# Altium project Opioid - rev.A0.PrjPCB
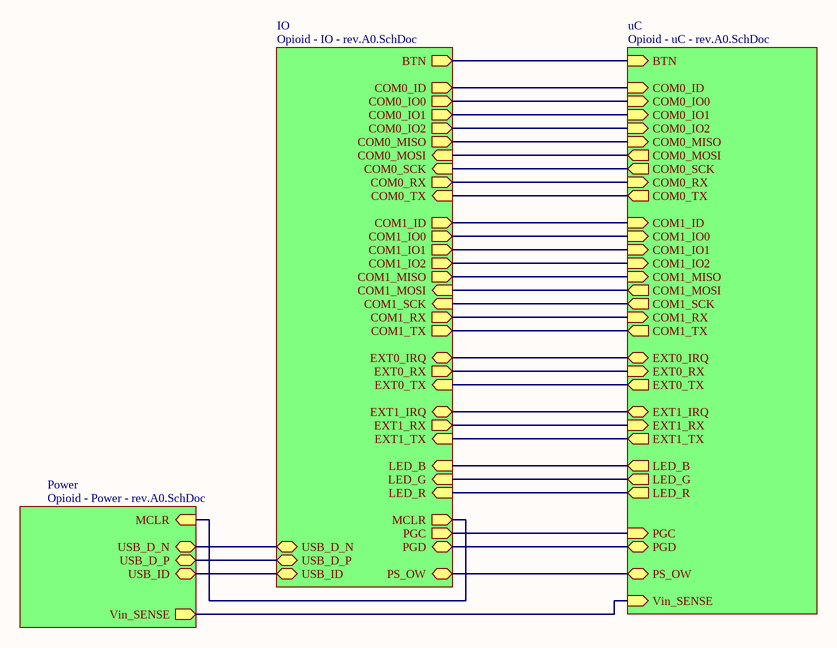
[diagram p0: Opioid - rev.A0.SchDoc]
4 sheets, 55 parts. Net scope: hierarchical (ports join the sheet entries above them; power ports are global).
Board file: Opioid - rev.A0.PcbDoc
Sheets:
  Opioid - rev.A0.SchDoc
    IO = Opioid - IO - rev.A0.SchDoc
    uC = Opioid - uC - rev.A0.SchDoc
    Power = Opioid - Power - rev.A0.SchDoc

## Sheet Opioid - rev.A0.SchDoc
size A4

### Sub-sheets
IO = Opioid - IO - rev.A0.SchDoc: BTN (out), COM0_ID (out), COM0_IO0 (out), COM0_IO1 (out), COM0_IO2 (out), COM0_MISO (out), COM0_MOSI (in), COM0_RX (out), COM0_TX (in), COM0_SCK (in), COM1_ID (out), COM1_IO0 (out), COM1_IO1 (out), COM1_IO2 (out), COM1_MISO (out), COM1_MOSI (in), COM1_SCK (in), COM1_RX (out), COM1_TX (out), EXT0_IRQ (bidir), EXT0_RX (out), EXT0_TX (in), EXT1_IRQ (bidir), EXT1_RX (out), EXT1_TX (in), LED_B (in), LED_G (in), LED_R (in), MCLR (out), PGC (out), PGD (bidir), PS_OW (bidir), USB_D_N (bidir), USB_D_P (bidir), USB_ID (bidir)
Power = Opioid - Power - rev.A0.SchDoc: MCLR (in), USB_D_N (bidir), USB_D_P (bidir), USB_ID (bidir), Vin_SENSE (out)
uC = Opioid - uC - rev.A0.SchDoc: BTN (in), COM0_ID (in), COM0_IO0 (in), COM0_IO1 (in), COM0_IO2 (in), COM0_MISO (in), COM0_MOSI (out), COM0_SCK (out), COM0_RX (in), COM0_TX (out), COM1_ID (in), COM1_IO0 (in), COM1_IO1 (in), COM1_IO2 (in), COM1_MISO (in), COM1_MOSI (out), COM1_SCK (out), COM1_TX (out), COM1_RX (in), EXT0_RX (in), EXT0_IRQ (bidir), EXT0_TX (out), EXT1_IRQ (bidir), EXT1_RX (in), EXT1_TX (out), LED_B (out), LED_G (out), LED_R (out), PS_OW (bidir), Vin_SENSE (in), PGC (in), PGD (bidir)

### Nets
USB_D_N: sheet IO/USB_D_N, sheet Power/USB_D_N
USB_D_P: sheet IO/USB_D_P, sheet Power/USB_D_P
NetB1_2: sheet IO/BTN, sheet uC/BTN
NetCOM0_1: sheet IO/COM0_ID, sheet uC/COM0_ID
NetCOM0_2: sheet IO/COM0_IO0, sheet uC/COM0_IO0
NetCOM0_3: sheet IO/COM0_IO1, sheet uC/COM0_IO1
NetCOM0_4: sheet IO/COM0_IO2, sheet uC/COM0_IO2
NetCOM0_5: sheet IO/COM0_MISO, sheet uC/COM0_MISO
NetCOM0_6: sheet IO/COM0_MOSI, sheet uC/COM0_MOSI
NetCOM0_7: sheet IO/COM0_SCK, sheet uC/COM0_SCK
NetCOM0_8: sheet IO/COM0_RX, sheet uC/COM0_RX
NetCOM0_9: sheet IO/COM0_TX, sheet uC/COM0_TX
NetCOM1_1: sheet IO/COM1_ID, sheet uC/COM1_ID
NetCOM1_2: sheet IO/COM1_IO0, sheet uC/COM1_IO0
NetCOM1_3: sheet IO/COM1_IO1, sheet uC/COM1_IO1
NetCOM1_4: sheet IO/COM1_IO2, sheet uC/COM1_IO2
NetCOM1_5: sheet IO/COM1_MISO, sheet uC/COM1_MISO
NetCOM1_6: sheet IO/COM1_MOSI, sheet uC/COM1_MOSI
NetCOM1_7: sheet IO/COM1_SCK, sheet uC/COM1_SCK
NetCOM1_8: sheet IO/COM1_RX, sheet uC/COM1_RX
NetCOM1_9: sheet IO/COM1_TX, sheet uC/COM1_TX
NetCONN1_4: sheet IO/USB_ID, sheet Power/USB_ID
NetEXT0_DATA_1: sheet IO/EXT0_IRQ, sheet uC/EXT0_IRQ
NetEXT0_DATA_2: sheet IO/EXT0_TX, sheet uC/EXT0_TX
NetEXT0_DATA_3: sheet IO/EXT0_RX, sheet uC/EXT0_RX
NetEXT1_DATA_1: sheet IO/EXT1_IRQ, sheet uC/EXT1_IRQ
NetEXT1_DATA_2: sheet IO/EXT1_TX, sheet uC/EXT1_TX
NetEXT1_DATA_3: sheet IO/EXT1_RX, sheet uC/EXT1_RX
NetICSP_1: sheet IO/MCLR, sheet Power/MCLR
NetICSP_4: sheet IO/PGD, sheet uC/PGD
NetICSP_5: sheet IO/PGC, sheet uC/PGC
NetPS_1: sheet IO/PS_OW, sheet uC/PS_OW
NetR2_2: sheet IO/LED_R, sheet uC/LED_R
NetR4_2: sheet IO/LED_G, sheet uC/LED_G
NetR5_2: sheet IO/LED_B, sheet uC/LED_B
NetR6_1: sheet uC/Vin_SENSE, sheet Power/Vin_SENSE

## Sheet Opioid - IO - rev.A0.SchDoc
size A4
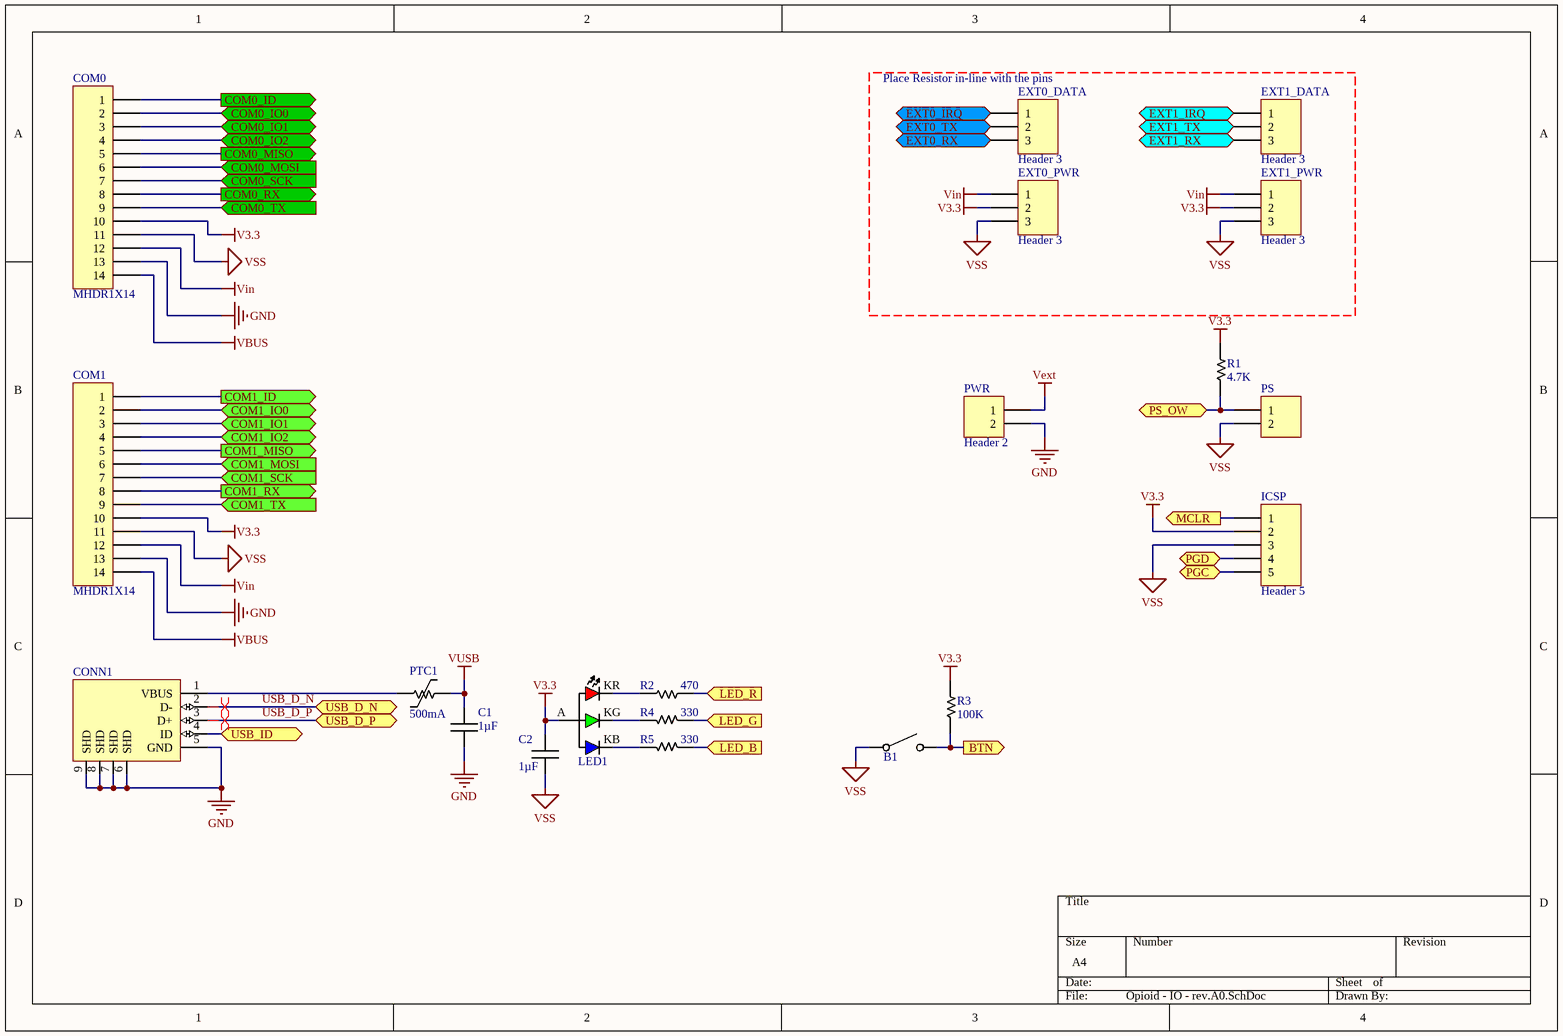
[diagram p1: Opioid - IO - rev.A0.SchDoc]

### Parts
B1  Tact Button NO  [Tact TH 4pin 6×6mm]  (value not drawn)
C1  1µF  [CAPC1608N]
C2  1µF  [CAPC1608N]
COM0  MHDR1X14  [MHDR1X14]
COM1  MHDR1X14  [MHDR1X14]
CONN1  USB-Conn Mini-B SMD  [440478]  (value not drawn)
EXT0_DATA  Header 3  [HDR1X3]
EXT0_PWR  Header 3  [HDR1X3]
EXT1_DATA  Header 3  [HDR1X3]
EXT1_PWR  Header 3  [HDR1X3]
ICSP  Header 5  [HDR1X5]
LED1  LED RGB common A  [LED 3528m]  (value not drawn)
PS  MHDR1X2  [MHDR1X2]  (value not drawn)
PTC1  500mA  [RESC3225N]
PWR  Header 2  [HDR1X2]
R1  4.7K  [RESC1608N]
R2  470  [RESC1608N]
R3  100K  [RESC1608N]
R4  330  [RESC1608N]
R5  330  [RESC1608N]

### Ports
BTN (out), COM0_ID (out), COM0_IO0 (bidir), COM0_IO1 (bidir), COM0_IO2 (bidir), COM0_MISO (out), COM0_MOSI (in), COM0_RX (out), COM0_SCK (in), COM0_TX (in), COM1_ID (out), COM1_IO0 (bidir), COM1_IO1 (bidir), COM1_IO2 (bidir), COM1_MISO (out), COM1_MOSI (in), COM1_RX (out), COM1_SCK (in), COM1_TX (in), EXT0_IRQ (bidir), EXT0_RX (out), EXT0_TX (in), EXT1_IRQ (bidir), EXT1_RX (out), EXT1_TX (in), LED_B (in), LED_G (in), LED_R (in), MCLR (out), PGC (bidir), PGD (bidir), PS_OW (bidir), USB_D_N (bidir), USB_D_P (bidir), USB_ID (bidir)

### Nets
GND: C1.1 COM0.13 COM1.13 CONN1.5(GND) CONN1.6(SHD) CONN1.7(SHD) CONN1.8(SHD) CONN1.9(SHD) PWR.2
V3.3: C2.2 COM0.10 COM1.10 EXT0_PWR.2 EXT1_PWR.2 ICSP.2 LED1.A R1.2 R3.2
VBUS: COM0.14 COM1.14
Vext: PWR.1
Vin: COM0.12 COM1.12 EXT0_PWR.1 EXT1_PWR.1
VSS: B1.1 C2.1 COM0.11 COM1.11 EXT0_PWR.3 EXT1_PWR.3 ICSP.3 PS.2
VUSB: C1.2 PTC1.2
USB_D_N: CONN1.2(D-) ; port USB_D_N
USB_D_P: CONN1.3(D+) ; port USB_D_P
NetB1_2: B1.2 R3.1 ; port BTN
NetCOM0_1: COM0.1 ; port COM0_ID
NetCOM0_2: COM0.2 ; port COM0_IO0
NetCOM0_3: COM0.3 ; port COM0_IO1
NetCOM0_4: COM0.4 ; port COM0_IO2
NetCOM0_5: COM0.5 ; port COM0_MISO
NetCOM0_6: COM0.6 ; port COM0_MOSI
NetCOM0_7: COM0.7 ; port COM0_SCK
NetCOM0_8: COM0.8 ; port COM0_RX
NetCOM0_9: COM0.9 ; port COM0_TX
NetCOM1_1: COM1.1 ; port COM1_ID
NetCOM1_2: COM1.2 ; port COM1_IO0
NetCOM1_3: COM1.3 ; port COM1_IO1
NetCOM1_4: COM1.4 ; port COM1_IO2
NetCOM1_5: COM1.5 ; port COM1_MISO
NetCOM1_6: COM1.6 ; port COM1_MOSI
NetCOM1_7: COM1.7 ; port COM1_SCK
NetCOM1_8: COM1.8 ; port COM1_RX
NetCOM1_9: COM1.9 ; port COM1_TX
NetCONN1_1: CONN1.1(VBUS) PTC1.1
NetCONN1_4: CONN1.4(ID) ; port USB_ID
NetEXT0_DATA_1: EXT0_DATA.1 ; port EXT0_IRQ
NetEXT0_DATA_2: EXT0_DATA.2 ; port EXT0_TX
NetEXT0_DATA_3: EXT0_DATA.3 ; port EXT0_RX
NetEXT1_DATA_1: EXT1_DATA.1 ; port EXT1_IRQ
NetEXT1_DATA_2: EXT1_DATA.2 ; port EXT1_TX
NetEXT1_DATA_3: EXT1_DATA.3 ; port EXT1_RX
NetICSP_1: ICSP.1 ; port MCLR
NetICSP_4: ICSP.4 ; port PGD
NetICSP_5: ICSP.5 ; port PGC
NetLED1_KB: LED1.KB R5.1
NetLED1_KG: LED1.KG R4.1
NetLED1_KR: LED1.KR R2.1
NetPS_1: PS.1 R1.1 ; port PS_OW
NetR2_2: R2.2 ; port LED_R
NetR4_2: R4.2 ; port LED_G
NetR5_2: R5.2 ; port LED_B

### Layout directives
differential pair: USB_D_N, USB_D_P

### Notes on the sheet
- (near EXT0_DATA) Place Resistor in-line with the pins

### Library data of the parts
B1 = Tact Button NO: pin to pad: 1>1+2 2>3+4
C1 C2 = Capacitor: Value: 1µF
COM0 COM1 = MHDR1X14: Header, 14-Pin; LatestRevisionDate: 17-Jul-2002; LatestRevisionNote: Re-released for DXP Platform.; Publisher: Altium Limited
EXT0_DATA EXT0_PWR EXT1_DATA EXT1_PWR = Header 3: Header, 3-Pin; LatestRevisionDate: 17-Jul-2002; LatestRevisionNote: Re-released for DXP Platform.; Publisher: Altium Limited
ICSP = Header 5: Header, 5-Pin; LatestRevisionDate: 17-Jul-2002; LatestRevisionNote: Re-released for DXP Platform.; Publisher: Altium Limited
LED1 = LED RGB common A: pin to pad: A>2 KB>3 KG>4 KR>1
PS = MHDR1X2: Header, 2-Pin; LatestRevisionDate: 17-Jul-2002; LatestRevisionNote: Re-released for DXP Platform.; Publisher: Altium Limited
PTC1 = PTC: Trip_Current: 500mA
PWR = Header 2: Header, 2-Pin; LatestRevisionDate: 17-Jul-2002; LatestRevisionNote: Re-released for DXP Platform.; Publisher: Altium Limited
R1-R5 = Resistor
  R1: Value: 4.7K
  R2: Value: 470
  R3: Value: 100K
  R4 R5: Value: 330

## Sheet Opioid - uC - rev.A0.SchDoc
size A4
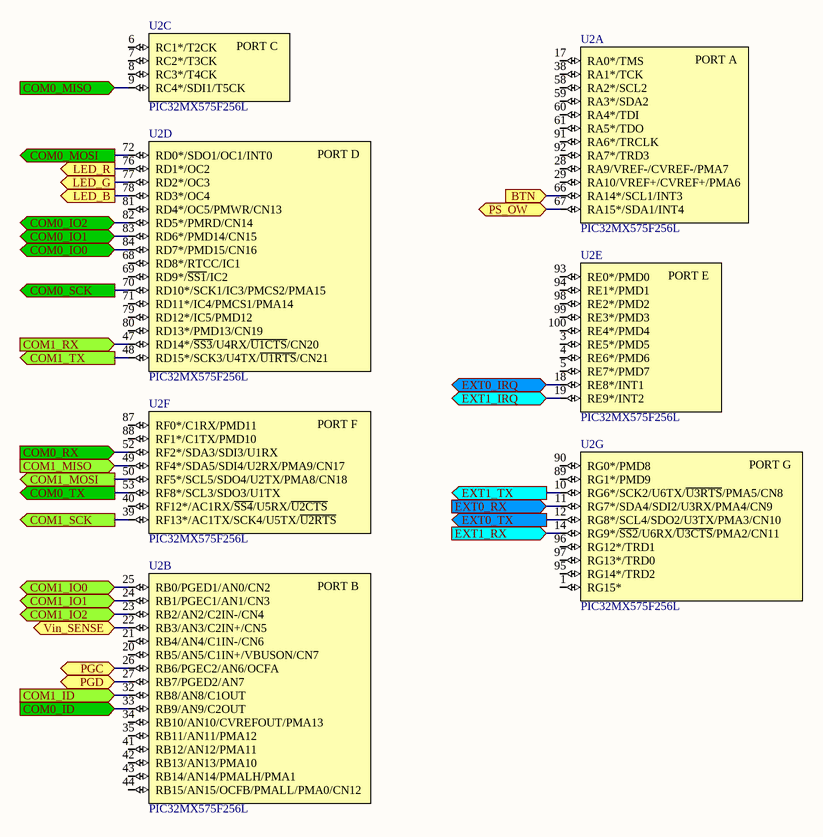
[diagram p2: Opioid - uC - rev.A0.SchDoc]

### Parts
U2  PIC32MX575F256L  [TQFP-PT100_N]  (parts A,B,C,D,E,F,G of 9)

### Ports
BTN (in), COM0_ID (in), COM0_IO0 (bidir), COM0_IO1 (bidir), COM0_IO2 (bidir), COM0_MISO (in), COM0_MOSI (out), COM0_RX (in), COM0_SCK (out), COM0_TX (out), COM1_ID (in), COM1_IO0 (bidir), COM1_IO1 (bidir), COM1_IO2 (bidir), COM1_MISO (in), COM1_MOSI (out), COM1_RX (in), COM1_SCK (out), COM1_TX (out), EXT0_IRQ (bidir), EXT0_RX (in), EXT0_TX (out), EXT1_IRQ (bidir), EXT1_RX (in), EXT1_TX (out), LED_B (out), LED_G (out), LED_R (out), PGC (bidir), PGD (bidir), PS_OW (bidir), Vin_SENSE (bidir)

### Nets
NetB1_2: U2.66(RA14*/SCL1/INT3) ; port BTN
NetCOM0_1: U2.33(RB9/AN9/C2OUT) ; port COM0_ID
NetCOM0_2: U2.84(RD7*/PMD15/CN16) ; port COM0_IO0
NetCOM0_3: U2.83(RD6*/PMD14/CN15) ; port COM0_IO1
NetCOM0_4: U2.82(RD5*/PMRD/CN14) ; port COM0_IO2
NetCOM0_5: U2.9(RC4*/SDI1/T5CK) ; port COM0_MISO
NetCOM0_6: U2.72(RD0*/SDO1/OC1/INT0) ; port COM0_MOSI
NetCOM0_7: U2.70(RD10*/SCK1/IC3/PMCS2/PMA15) ; port COM0_SCK
NetCOM0_8: U2.52(RF2*/SDA3/SDI3/U1RX) ; port COM0_RX
NetCOM0_9: U2.53(RF8*/SCL3/SDO3/U1TX) ; port COM0_TX
NetCOM1_1: U2.32(RB8/AN8/C1OUT) ; port COM1_ID
NetCOM1_2: U2.25(RB0/PGED1/AN0/CN2) ; port COM1_IO0
NetCOM1_3: U2.24(RB1/PGEC1/AN1/CN3) ; port COM1_IO1
NetCOM1_4: U2.23(RB2/AN2/C2IN-/CN4) ; port COM1_IO2
NetCOM1_5: U2.49(RF4*/SDA5/SDI4/U2RX/PMA9/CN17) ; port COM1_MISO
NetCOM1_6: U2.50(RF5*/SCL5/SDO4/U2TX/PMA8/CN18) ; port COM1_MOSI
NetCOM1_7: U2.39(RF13*/AC1TX/SCK4/U5TX/~{U2RTS}) ; port COM1_SCK
NetCOM1_8: U2.47(RD14*/~{SS3}/U4RX/~{U1CTS}/CN20) ; port COM1_RX
NetCOM1_9: U2.48(RD15*/SCK3/U4TX/~{U1RTS}/CN21) ; port COM1_TX
NetEXT0_DATA_1: U2.18(RE8*/INT1) ; port EXT0_IRQ
NetEXT0_DATA_2: U2.12(RG8*/SCL4/SDO2/U3TX/PMA3/CN10) ; port EXT0_TX
NetEXT0_DATA_3: U2.11(RG7*/SDA4/SDI2/U3RX/PMA4/CN9) ; port EXT0_RX
NetEXT1_DATA_1: U2.19(RE9*/INT2) ; port EXT1_IRQ
NetEXT1_DATA_2: U2.10(RG6*/SCK2/U6TX/~{U3RTS}/PMA5/CN8) ; port EXT1_TX
NetEXT1_DATA_3: U2.14(RG9*/~{SS2}/U6RX/~{U3CTS}/PMA2/CN11) ; port EXT1_RX
NetICSP_4: U2.27(RB7/PGED2/AN7) ; port PGD
NetICSP_5: U2.26(RB6/PGEC2/AN6/OCFA) ; port PGC
NetPS_1: U2.67(RA15*/SDA1/INT4) ; port PS_OW
NetR2_2: U2.76(RD1*/OC2) ; port LED_R
NetR4_2: U2.77(RD2*/OC3) ; port LED_G
NetR5_2: U2.78(RD3*/OC4) ; port LED_B
NetR6_1: U2.22(RB3/AN3/C2IN+/CN5) ; port Vin_SENSE

Not connected (* = marked no-connect by the designer): U2 1(RG15*) 3(RE5*/PMD5) 4(RE6*/PMD6) 5(RE7*/PMD7) 6(RC1*/T2CK) 7(RC2*/T3CK) 8(RC3*/T4CK) 17(RA0*/TMS) 20(RB5/AN5/C1IN+/VBUSON/CN7) 21(RB4/AN4/C1IN-/CN6) 28(RA9/VREF-/CVREF-/PMA7) 29(RA10/VREF+/CVREF+/PMA6) 34(RB10/AN10/CVREFOUT/PMA13) 35(RB11/AN11/PMA12) 38(RA1*/TCK) 40(RF12*/AC1RX/~{SS4}/U5RX/~{U2CTS}) 41(RB12/AN12/PMA11) 42(RB13/AN13/PMA10) 43(RB14/AN14/PMALH/PMA1) 44(RB15/AN15/OCFB/PMALL/PMA0/CN12) 58(RA2*/SCL2) 59(RA3*/SDA2) 60(RA4*/TDI) 61(RA5*/TDO) 68(RD8*/RTCC/IC1) 69(RD9*/~{SS1}/IC2) 71(RD11*/IC4/PMCS1/PMA14) 79(RD12*/IC5/PMD12) 80(RD13*/PMD13/CN19) 81(RD4*/OC5/PMWR/CN13) 87(RF0*/C1RX/PMD11) 88(RF1*/C1TX/PMD10) 89(RG1*/PMD9) 90(RG0*/PMD8) 91(RA6*/TRCLK) 92(RA7*/TRD3) 93(RE0*/PMD0) 94(RE1*/PMD1) 95(RG14*/TRD2) 96(RG12*/TRD1) 97(RG13*/TRD0) 98(RE2*/PMD2) 99(RE3*/PMD3) 100(RE4*/PMD4)

### Notes on the sheet
- (in symbol PIC32MX575F256L, part A) PORT A
- (in symbol PIC32MX575F256L, part B) PORT B
- (in symbol PIC32MX575F256L, part C) PORT C
- (in symbol PIC32MX575F256L, part D) PORT D
- (in symbol PIC32MX575F256L, part E) PORT E
- (in symbol PIC32MX575F256L, part F) PORT F
- (in symbol PIC32MX575F256L, part G) PORT G

## Sheet Opioid - Power - rev.A0.SchDoc
size A4
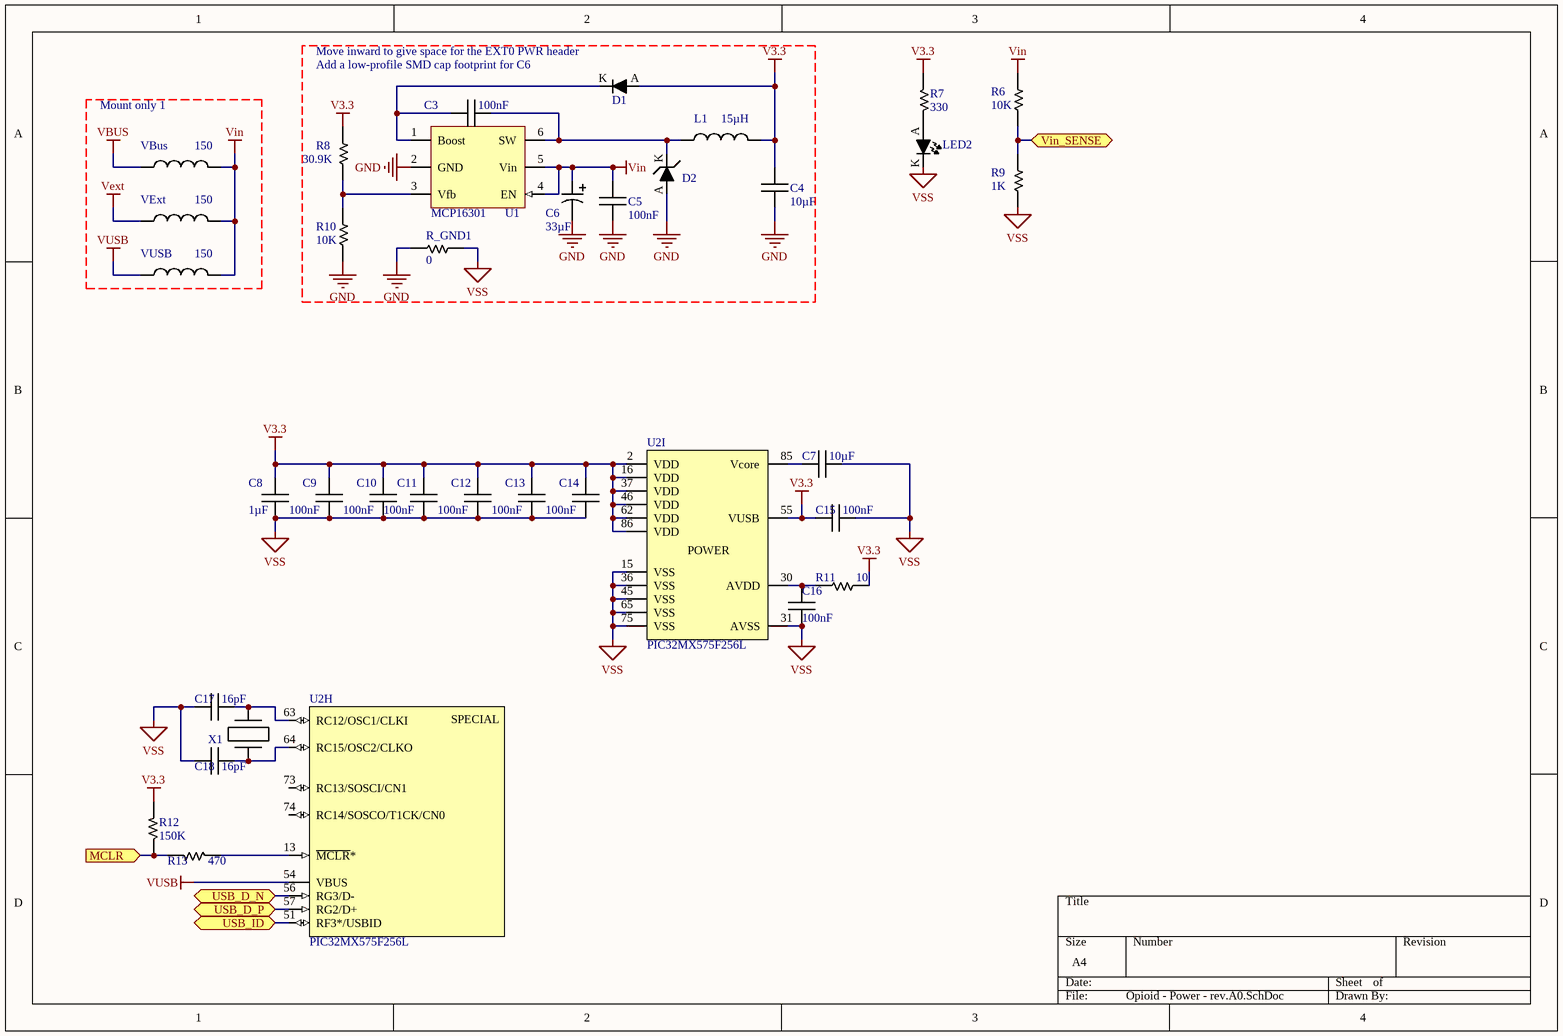
[diagram p3: Opioid - Power - rev.A0.SchDoc]

### Parts
C3  100nF  [CAPC1608N]
C4  10µF  [CAPC2012N]
C5  100nF  [CAPC1608N]
C6  33µF  [CAPPR2-5x11]
C7  10µF  [CAPC2012N]
C8  1µF  [CAPC1608N]
C9  100nF  [CAPC1608N]
C10  100nF  [CAPC1608N]
C11  100nF  [CAPC1608N]
C12  100nF  [CAPC1608N]
C13  100nF  [CAPC1608N]
C14  100nF  [CAPC1608N]
C15  100nF  [CAPC1608N]
C16  100nF  [CAPC1608N]
C17  16pF  [CAPC2012N]
C18  16pF  [CAPC2012N]
D1  Diode  [SOT323]  (value not drawn)
D2  Schottky Diode  [DO-214AC]  (value not drawn)
L1  15µH  [INDUCTOR 6×6mm Taiyo Yuden]
LED2  (no value)  [LED 1608m]
R6  10K  [RESC1608N]
R7  330  [RESC1608N]
R8  30.9K  [RESC1608N]
R9  1K  [RESC1608N]
R10  10K  [RESC1608N]
R11  10  [RESC1608N]
R12  150K  [RESC1608N]
R13  470  [RESC1608N]
R_GND1  0  [RESC1608N]
U1  MCP16301  [SOT23-6_N]
U2  PIC32MX575F256L  [TQFP-PT100_N]  (parts H,I of 9)
VBus  150  [INDC1608N]
VExt  150  [INDC1608N]
VUSB  150  [INDC1608N]
X1  Crystal  [BCY-W2/D3.1]  (value not drawn)

### Ports
MCLR (in), USB_D_N (bidir), USB_D_P (bidir), USB_ID (bidir), Vin_SENSE (bidir)

### Nets
GND: C4.1 C5.2 C6.2 D2.A(Anode) R10.1 R_GND1.1 U1.2(GND)
V3.3: C4.2 C8.2 C9.2 C10.2 C11.2 C12.2 C13.2 C14.2 C15.2 D1.A L1.2 R7.1 R8.2 R11.2 R12.2 U2.2(VDD) U2.16(VDD) U2.37(VDD) U2.46(VDD) U2.55(VUSB) U2.62(VDD) U2.86(VDD)
VBUS: VBus.1
Vext: VExt.1
Vin: C5.1 C6.1 R6.2 U1.4(EN) U1.5(Vin) VBus.2 VExt.2 VUSB.2
VSS: C7.1 C8.1 C9.1 C10.1 C11.1 C12.1 C13.1 C14.1 C15.1 C16.1 C17.2 C18.2 LED2.K R9.1 R_GND1.2 U2.15(VSS) U2.31(AVSS) U2.36(VSS) U2.45(VSS) U2.65(VSS) U2.75(VSS)
VUSB: U2.54(VBUS) VUSB.1
USB_D_N: U2.56(RG3/D-) ; port USB_D_N
USB_D_P: U2.57(RG2/D+) ; port USB_D_P
NetC3_1: C3.1 D2.K(Kathode) L1.1 U1.6(SW)
NetC3_2: C3.2 D1.K U1.1(Boost)
NetC7_2: C7.2 U2.85(Vcore)
NetC16_2: C16.2 R11.1 U2.30(AVDD)
NetC17_1: C17.1 U2.63(RC12/OSC1/CLKI) X1.2
NetC18_1: C18.1 U2.64(RC15/OSC2/CLKO) X1.1
NetCONN1_4: U2.51(RF3*/USBID) ; port USB_ID
NetICSP_1: R12.1 R13.2 ; port MCLR
NetLED2_A: LED2.A R7.2
NetR6_1: R6.1 R9.2 ; port Vin_SENSE
NetR8_1: R8.1 R10.2 U1.3(Vfb)
NetR13_1: R13.1 U2.13(~{MCLR}*)

Not connected (* = marked no-connect by the designer): U2 73(RC13/SOSCI/CN1) 74(RC14/SOSCO/T1CK/CN0)

### Notes on the sheet
- Mount only 1
- (near D1) Move inward to give space for the EXT0 PWR header
- Add a low-profile SMD cap footprint for C6
- (in symbol PIC32MX575F256L, part H) SPECIAL
- (in symbol PIC32MX575F256L, part I) POWER

### Library data of the parts
C3 C5 = Capacitor: Voltage Rating: 50V; Value: 100nF
C4 C7-C18 = Capacitor
  C4 C7: Value: 10µF
  C8: Value: 1µF
  C9-C16: Value: 100nF
  C17 C18: Value: 16pF
C6 = Capacitor Polarised: Voltage Rating: 50V; Value: 33µF
D1 = Diode: pin to pad: A>1 K>3; Model: M1MA141KT1G
D2 = Schottky Diode: Model: SS14
L1 VBus VExt VUSB = Inductor
  L1: Value: 15µH
  VBus VExt VUSB: Value: 150
LED2 = LED: pin to pad: A>1 K>2
R6-R13 R_GND1 = Resistor
  R6 R10: Value: 10K
  R7: Value: 330
  R8: Value: 30.9K
  R9: Value: 1K
  R11: Value: 10
  R12: Value: 150K
  R13: Value: 470
  R_GND1: Value: 0
X1 = Crystal: Frequency: 16MHz; Precision: 100ppm; Stability: 100ppm
U1 = MCP16301: Vout: *

## Nets that join several sheets
GND: Opioid - IO - rev.A0 (9 pins), Opioid - Power - rev.A0 (7 pins)
V3.3: Opioid - IO - rev.A0 (9 pins), Opioid - Power - rev.A0 (22 pins)
VBUS: Opioid - IO - rev.A0 (COM0.14 COM1.14), Opioid - Power - rev.A0 (VBus.1)
Vext: Opioid - IO - rev.A0 (PWR.1), Opioid - Power - rev.A0 (VExt.1)
Vin: Opioid - IO - rev.A0 (COM0.12 COM1.12 EXT0_PWR.1 EXT1_PWR.1), Opioid - Power - rev.A0 (8 pins)
VSS: Opioid - IO - rev.A0 (8 pins), Opioid - Power - rev.A0 (21 pins)
VUSB: Opioid - IO - rev.A0 (C1.2 PTC1.2), Opioid - Power - rev.A0 (U2.54 VUSB.1)
NetB1_2: Opioid - IO - rev.A0 (B1.2 R3.1), Opioid - uC - rev.A0 (U2.66)
NetCOM0_1: Opioid - IO - rev.A0 (COM0.1), Opioid - uC - rev.A0 (U2.33)
NetCOM0_2: Opioid - IO - rev.A0 (COM0.2), Opioid - uC - rev.A0 (U2.84)
NetCOM0_3: Opioid - IO - rev.A0 (COM0.3), Opioid - uC - rev.A0 (U2.83)
NetCOM0_4: Opioid - IO - rev.A0 (COM0.4), Opioid - uC - rev.A0 (U2.82)
NetCOM0_5: Opioid - IO - rev.A0 (COM0.5), Opioid - uC - rev.A0 (U2.9)
NetCOM0_6: Opioid - IO - rev.A0 (COM0.6), Opioid - uC - rev.A0 (U2.72)
NetCOM0_7: Opioid - IO - rev.A0 (COM0.7), Opioid - uC - rev.A0 (U2.70)
NetCOM0_8: Opioid - IO - rev.A0 (COM0.8), Opioid - uC - rev.A0 (U2.52)
NetCOM0_9: Opioid - IO - rev.A0 (COM0.9), Opioid - uC - rev.A0 (U2.53)
NetCOM1_1: Opioid - IO - rev.A0 (COM1.1), Opioid - uC - rev.A0 (U2.32)
NetCOM1_2: Opioid - IO - rev.A0 (COM1.2), Opioid - uC - rev.A0 (U2.25)
NetCOM1_3: Opioid - IO - rev.A0 (COM1.3), Opioid - uC - rev.A0 (U2.24)
NetCOM1_4: Opioid - IO - rev.A0 (COM1.4), Opioid - uC - rev.A0 (U2.23)
NetCOM1_5: Opioid - IO - rev.A0 (COM1.5), Opioid - uC - rev.A0 (U2.49)
NetCOM1_6: Opioid - IO - rev.A0 (COM1.6), Opioid - uC - rev.A0 (U2.50)
NetCOM1_7: Opioid - IO - rev.A0 (COM1.7), Opioid - uC - rev.A0 (U2.39)
NetCOM1_8: Opioid - IO - rev.A0 (COM1.8), Opioid - uC - rev.A0 (U2.47)
NetCOM1_9: Opioid - IO - rev.A0 (COM1.9), Opioid - uC - rev.A0 (U2.48)
NetCONN1_4: Opioid - IO - rev.A0 (CONN1.4), Opioid - Power - rev.A0 (U2.51)
NetEXT0_DATA_1: Opioid - IO - rev.A0 (EXT0_DATA.1), Opioid - uC - rev.A0 (U2.18)
NetEXT0_DATA_2: Opioid - IO - rev.A0 (EXT0_DATA.2), Opioid - uC - rev.A0 (U2.12)
NetEXT0_DATA_3: Opioid - IO - rev.A0 (EXT0_DATA.3), Opioid - uC - rev.A0 (U2.11)
NetEXT1_DATA_1: Opioid - IO - rev.A0 (EXT1_DATA.1), Opioid - uC - rev.A0 (U2.19)
NetEXT1_DATA_2: Opioid - IO - rev.A0 (EXT1_DATA.2), Opioid - uC - rev.A0 (U2.10)
NetEXT1_DATA_3: Opioid - IO - rev.A0 (EXT1_DATA.3), Opioid - uC - rev.A0 (U2.14)
NetICSP_1: Opioid - IO - rev.A0 (ICSP.1), Opioid - Power - rev.A0 (R12.1 R13.2)
NetICSP_4: Opioid - IO - rev.A0 (ICSP.4), Opioid - uC - rev.A0 (U2.27)
NetICSP_5: Opioid - IO - rev.A0 (ICSP.5), Opioid - uC - rev.A0 (U2.26)
NetPS_1: Opioid - IO - rev.A0 (PS.1 R1.1), Opioid - uC - rev.A0 (U2.67)
NetR2_2: Opioid - IO - rev.A0 (R2.2), Opioid - uC - rev.A0 (U2.76)
NetR4_2: Opioid - IO - rev.A0 (R4.2), Opioid - uC - rev.A0 (U2.77)
NetR5_2: Opioid - IO - rev.A0 (R5.2), Opioid - uC - rev.A0 (U2.78)
NetR6_1: Opioid - uC - rev.A0 (U2.22), Opioid - Power - rev.A0 (R6.1 R9.2)
USB_D_N: Opioid - IO - rev.A0 (CONN1.2), Opioid - Power - rev.A0 (U2.56)
USB_D_P: Opioid - IO - rev.A0 (CONN1.3), Opioid - Power - rev.A0 (U2.57)